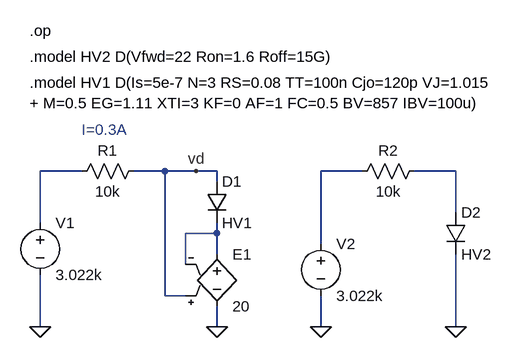
[diagram p0: schematic hv_diode2.asc]
hv_diode2.asc, the LTspice schematic file:
Version 4
SHEET 1 1356 708
WIRE -496 80 -496 0
WIRE -496 240 -496 160
WIRE -432 0 -496 0
WIRE -304 0 -352 0
WIRE -304 192 -304 0
WIRE -272 144 -272 96
WIRE -272 192 -304 192
WIRE -256 0 -304 0
WIRE -224 0 -256 0
WIRE -224 16 -224 0
WIRE -224 96 -272 96
WIRE -224 96 -224 80
WIRE -224 128 -224 96
WIRE -224 240 -224 208
WIRE -64 112 -64 0
WIRE -64 240 -64 192
WIRE 0 0 -64 0
WIRE 144 0 80 0
WIRE 144 64 144 0
WIRE 144 240 144 128
FLAG -496 240 0
FLAG -256 0 vd
FLAG -64 240 0
FLAG 144 240 0
FLAG -224 240 0
SYMBOL diode -240 16 R0
SYMATTR InstName D1
SYMATTR Value HV1
SYMBOL voltage -496 64 R0
WINDOW 123 0 0 Left 0
WINDOW 39 0 0 Left 0
SYMATTR InstName V1
SYMATTR Value 3.022k
SYMBOL res -448 16 R270
WINDOW 0 32 56 VTop 0
WINDOW 3 0 56 VBottom 0
SYMATTR InstName R1
SYMATTR Value 10k
SYMBOL res -16 16 R270
WINDOW 0 32 56 VTop 0
WINDOW 3 0 56 VBottom 0
SYMATTR InstName R2
SYMATTR Value 10k
SYMBOL voltage -64 96 R0
WINDOW 123 0 0 Left 0
WINDOW 39 0 0 Left 0
SYMATTR InstName V2
SYMATTR Value 3.022k
SYMBOL diode 128 64 R0
SYMATTR InstName D2
SYMATTR Value HV2
SYMBOL e2 -224 112 R0
SYMATTR InstName E1
SYMATTR Value 20
TEXT -512 -216 Left 0 !.op
TEXT -512 -136 Left 0 !.model HV1 D(Is=5e-7 N=3 RS=0.08 TT=100n Cjo=120p VJ=1.015\n+ M=0.5 EG=1.11 XTI=3 KF=0 AF=1 FC=0.5 BV=857 IBV=100u)
TEXT -512 -176 Left 0 !.model HV2 D(Vfwd=22 Ron=1.6 Roff=15G)
TEXT -432 -64 Left 0 ;I=0.3A

The netlist it stands for:
* hv_diode2.asc
D1 vd N002 HV1
V1 N001 0 3.022k
R1 N001 vd 10k
R2 N003 N004 10k
V2 N003 0 3.022k
D2 N004 0 HV2
E1 N002 0 vd N002 20
.model D D
.lib standard.dio
.op
.model HV1 D(Is=5e-7 N=3 RS=0.08 TT=100n Cjo=120p VJ=1.015
+ M=0.5 EG=1.11 XTI=3 KF=0 AF=1 FC=0.5 BV=857 IBV=100u)
.model HV2 D(Vfwd=22 Ron=1.6 Roff=15G)
* I=0.3A
.backanno
.end